# Altium schematic sheet Controller.SchDoc
size A2
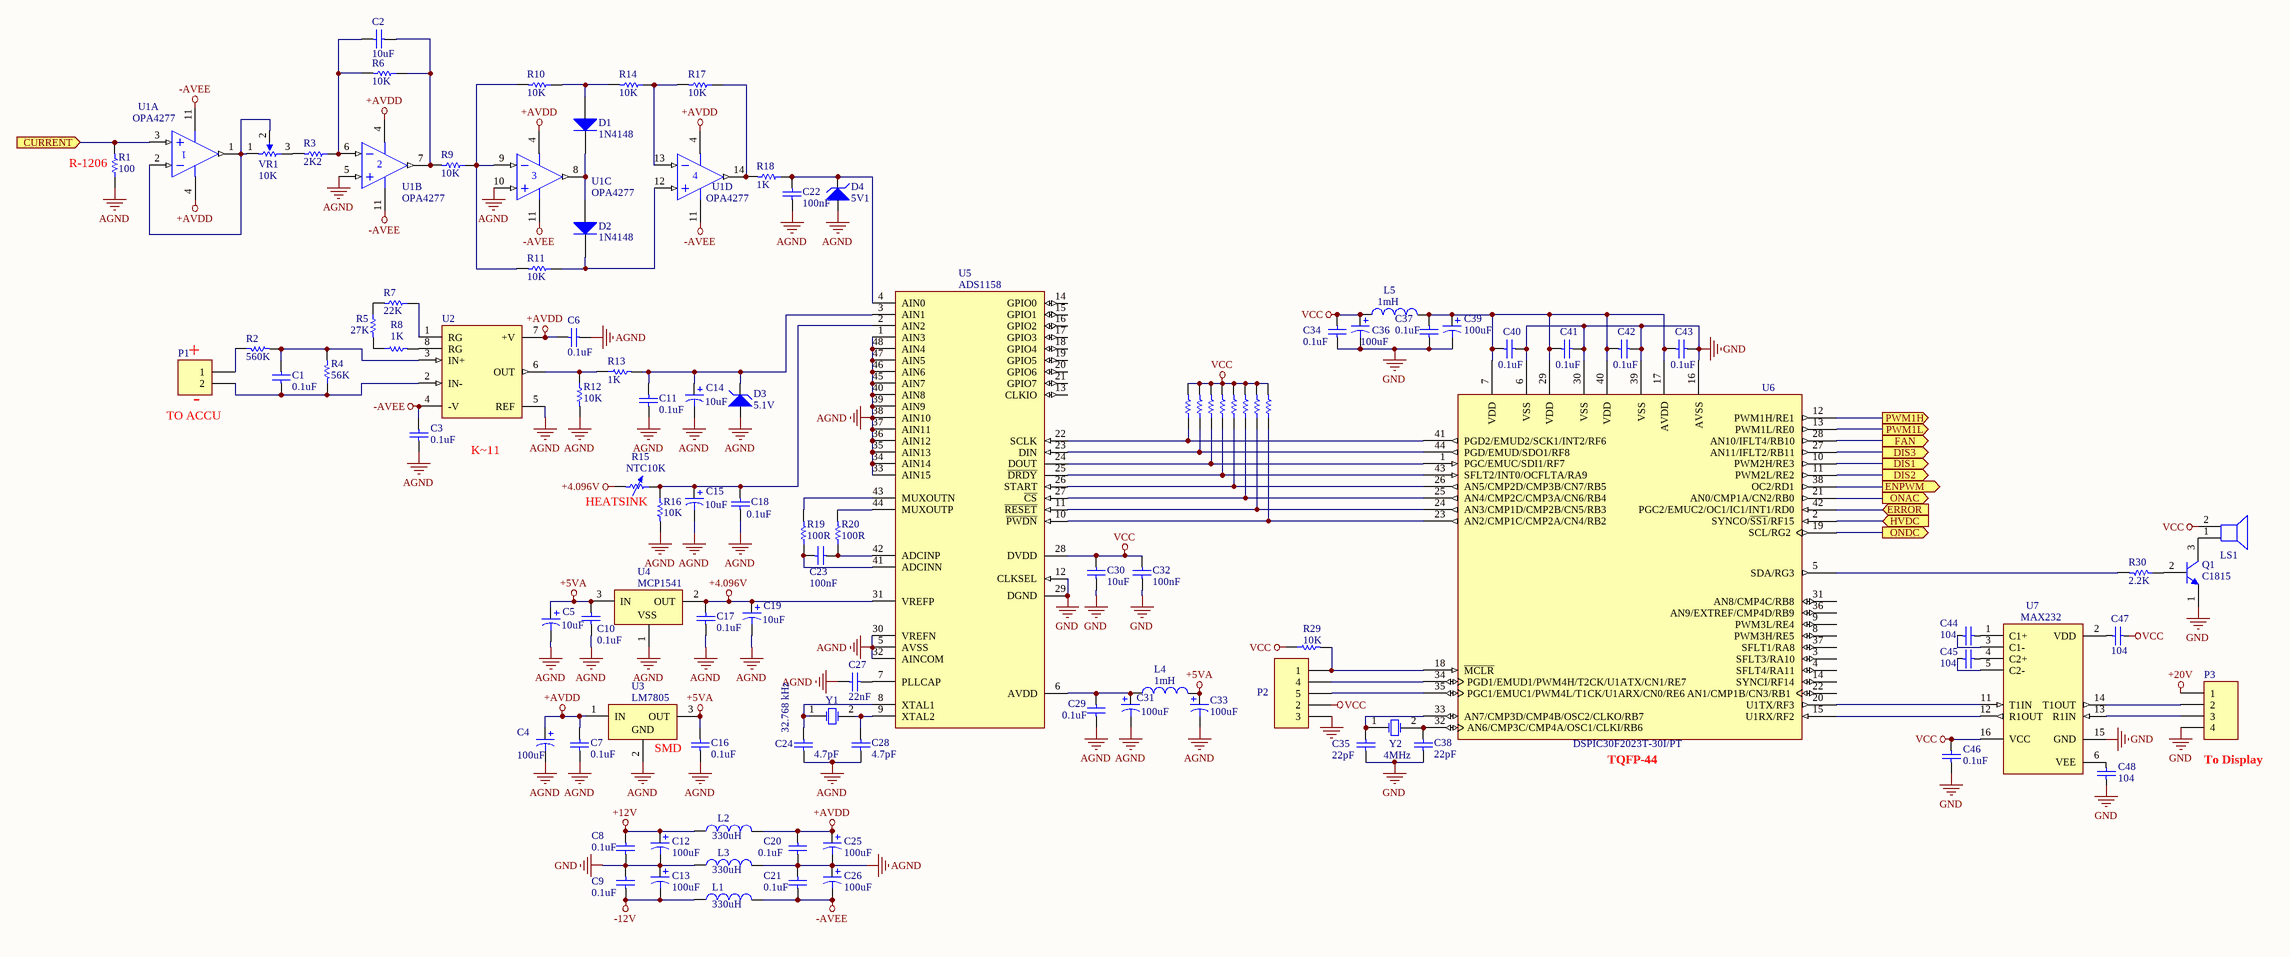
[diagram p0: Controller.SchDoc]

## Parts
C1  0.1uF  [C0805]
C2  10uF  [C0805]
C3  0.1uF  [C0805]
C4  100uF  [C107-SMD]
C5  10uF  [C106-SMD]
C6  0.1uF  [C0805]
C7  0.1uF  [C0805]
C8  0.1uF  [C0805]
C9  0.1uF  [C0805]
C10  0.1uF  [C0805]
C11  0.1uF  [C0805]
C12  100uF  [C107-SMD]
C13  100uF  [C107-SMD]
C14  10uF  [C106-SMD]
C15  10uF  [C106-SMD]
C16  0.1uF  [C0805]
C17  0.1uF  [C0805]
C18  0.1uF  [C0805]
C19  10uF  [C106-SMD]
C20  0.1uF  [C0805]
C21  0.1uF  [C0805]
C22  100nF  [C0805]
C23  100nF  [C0805]
C24  4.7pF  [C0805]
C25  100uF  [C107-SMD]
C26  100uF  [C107-SMD]
C27  22nF  [C0805]
C28  4.7pF  [C0805]
C29  0.1uF  [C0805]
C30  10uF  [C0805]
C31  100uF  [C107-SMD]
C32  100nF  [C0805]
C33  100uF  [C107-SMD]
C34  0.1uF  [C0805]
C35  22pF  [C0805]
C36  100uF  [C107-SMD]
C37  0.1uF  [C0805]
C38  22pF  [C0805]
C39  100uF  [C107-SMD]
C40  0.1uF  [C0805]
C41  0.1uF  [C0805]
C42  0.1uF  [C0805]
C43  0.1uF  [C0805]
C44  104  [C0805]
C45  104  [C0805]
C46  0.1uF  [C0805]
C47  104  [C0805]
C48  104  [C0805]
D1  1N4148  [1N4148-SMD]
D2  1N4148  [1N4148-SMD]
D3  5.1V  [1N4148]
D4  5V1  [1N4148]
L1  330uH  [L-330uH]
L2  330uH  [L-330uH]
L3  330uH  [L-330uH]
L4  1mH  [IND-7447785002]
L5  1mH  [IND-7447785002]
LS1  Speaker  [BEEPER]  (value not drawn)
P1  Header 2  [H2-15A]  (value not drawn)
P2  PROG-KITPIC3  [CON-5B]  (value not drawn)
P3  Header 4  [H4-15A]  (value not drawn)
Q1  C1815  [SOT-23]
R1  100  [R1206]
R2  560K  [R0805]
R3  2K2  [R0805]
R4  56K  [R0805]
R5  27K  [R0805]
R6  10K  [R0805]
R7  22K  [R0805]
R8  1K  [R0805]
R9  10K  [R0805]
R10  10K  [R0805]
R11  10K  [R0805]
R12  10K  [R0805]
R13  1K  [R0805]
R14  10K  [R0805]
R15  NTC10K  [CAP100]
R16  10K  [R0805]
R17  10K  [R0805]
R18  1K  [R0805]
R19  100R  [R0805]
R20  100R  [R0805]
R21  10K  [R0805]  (value not drawn)
R22  10K  [R0805]  (value not drawn)
R23  10K  [R0805]  (value not drawn)
R24  10K  [R0805]  (value not drawn)
R25  10K  [R0805]  (value not drawn)
R26  10K  [R0805]  (value not drawn)
R27  10K  [R0805]  (value not drawn)
R28  10K  [R0805]  (value not drawn)
R29  10K  [R0805]
R30  value 2.2K  [R0805]  (hidden comment: 2K2)
U1  value OPA4277  [SOIC-14]  (hidden comment: OPA4277UA)  (parts A,B,C,D of 4)
U2  INA121  [182H_M]  (value not drawn)
U3  LM7805  [78M05-SMD]
U4  MCP1541  [MCP1541]
U5  ADS1158  [ADS1158]
U6  DSPIC30F2023T-30I/PT  [TQFP-PT44_N]
U7  MAX232  [NSO16_M]
VR1  10K  [RPOT-PV36W]
Y1  32.768 kHz  [XTA-32.768K]
Y2  4MHz  [XTA_SMD]

## Ports
CURRENT (in), DIS1 (out), DIS2 (out), DIS3 (out), ENPWM (out), ERROR (in), FAN (out), HVDC (in), ONAC (out), ONDC (out), PWM1H (out), PWM1L (out)

## Nets
+4.096V: C17.1 C19.1 R15.1 U4.2(OUT) U5.31(VREFP)
+5VA: C5.1 C10.1 C16.1 C33.1 L4.1 U3.3(OUT) U4.3(IN)
+12V: C8.1 C12.1 L2.1
+20V: P3.1
+AVDD: C4.1 C6.1 C7.1 C20.1 C25.1 L2.2 U1.4(V+) U2.7(+V) U3.1(IN)
-12V: C9.2 C13.2 L1.1
-AVEE: C3.1 C21.2 C26.2 L1.2 U1.11(V-) U2.4(-V)
AGND: C3.2 C4.2 C5.2 C6.2 C7.2 C10.2 C11.2 C14.2 C15.2 C16.2 C17.2 C18.2 C19.2 C20.2 C21.1 C22.2 C24.2 C25.2 C26.1 C27.1 C28.2 C29.2 C31.2 C33.2 D3.1(A) D4.1(A) L3.2 R1.1 R12.2 R16.2 U1.5(IN+) U1.10(IN+) U2.5(REF) U3.2(GND) U4.1(VSS) U5.1(AIN3) U5.5(AVSS) U5.30(VREFN) U5.32(AINCOM) U5.33(AIN15) U5.34(AIN14) U5.35(AIN13) U5.36(AIN12) U5.37(AIN11) U5.38(AIN10) U5.39(AIN9) U5.40(AIN8) U5.45(AIN7) U5.46(AIN6) U5.47(AIN5) U5.48(AIN4) Y1.3(AGND)
GND: C8.2 C9.1 C12.2 C13.1 C30.1 C32.2 C34.2 C35.1 C36.2 C37.2 C38.1 C39.2 C40.2 C41.2 C42.2 C43.2 C46.2 C48.1 L3.1 P2.3 P3.4 Q1.1(E) U5.12(CLKSEL) U5.29(DGND) U6.6(VSS) U6.16(AVSS) U6.30(VSS) U6.39(VSS) U7.15(GND)
VCC: C30.2 C32.1 C34.1 C36.1 C46.1 C47.1 L5.1 LS1.2 P2.2 R21.2 R22.2 R23.2 R24.2 R25.2 R26.2 R27.2 R28.2 R29.1 U5.28(DVDD) U7.16(VCC)
CURRENT: R1.2 U1.3(IN+) ; port CURRENT
DIS1: U6.10(PWM2H/RE3) ; port DIS1
DIS2: U6.11(PWM2L/RE2) ; port DIS2
DIS3: U6.27(AN11/IFLT2/RB11) ; port DIS3
ENPWM: U6.38(OC2/RD1) ; port ENPWM
ERROR: U6.42(PGC2/EMUC2/OC1/IC1/INT1/RD0) ; port ERROR
FAN: U6.28(AN10/IFLT4/RB10) ; port FAN
HVDC: U6.2(SYNCO/~{SS1}/RF15) ; port HVDC
ONAC: U6.21(AN0/CMP1A/CN2/RB0) ; port ONAC
ONDC: U6.19(SCL/RG2) ; port ONDC
PWM1H: U6.12(PWM1H/RE1) ; port PWM1H
PWM1L: U6.13(PWM1L/RE0) ; port PWM1L
NetC1_1: C1.1 P1.2 R4.1 U2.2(IN-)
NetC1_2: C1.2 R2.2 R4.2 U2.3(IN+)
NetC2_1: C2.1 R6.1 R9.2 U1.7(OUT)
NetC2_2: C2.2 R3.1 R6.2 U1.6(IN-)
NetC11_1: C11.1 C14.1 D3.2(K) R13.2 U5.3(AIN1)
NetC15_1: C15.1 C18.1 R15.2 R16.1 U5.2(AIN2)
NetC22_1: C22.1 D4.2(K) R18.1 U5.4(AIN0)
NetC23_1: C23.1 R19.1 U5.41(ADCINN)
NetC23_2: C23.2 R20.1 U5.42(ADCINP)
NetC24_1: C24.1 U5.8(XTAL1) Y1.1(OSC1)
NetC27_2: C27.2 U5.7(PLLCAP)
NetC28_1: C28.1 U5.9(XTAL2) Y1.2(OSC2)
NetC29_1: C29.1 C31.1 L4.2 U5.6(AVDD)
NetC35_2: C35.2 U6.33(AN7/CMP3D/CMP4B/OSC2/CLKO/RB7) Y2.1(OSC1)
NetC37_1: C37.1 C39.1 C40.1 C41.1 C42.1 C43.1 L5.2 U6.7(VDD) U6.17(AVDD) U6.29(VDD) U6.40(VDD)
NetC38_2: C38.2 U6.32(AN6/CMP3C/CMP4A/OSC1/CLKI/RB6) Y2.2(OSC2)
NetC44_1: C44.1 U7.1(C1+)
NetC44_2: C44.2 U7.3(C1-)
NetC45_1: C45.1 U7.4(C2+)
NetC45_2: C45.2 U7.5(C2-)
NetC47_2: C47.2 U7.2(VDD)
NetC48_2: C48.2 U7.6(VEE)
NetD1_1: D1.1(A) R10.1 R14.2
NetD1_2: D1.2(K) D2.1(A) U1.8(OUT)
NetD2_2: D2.2(K) R11.1 U1.12(IN+)
NetLS1_1: LS1.1 Q1.3(C)
NetP1_1: P1.1 R2.1
NetP2_1: P2.1 R29.2 U6.18(~{MCLR})
NetP2_4: P2.4 U6.34(PGD1/EMUD1/PWM4H/T2CK/U1ATX/CN1/RE7)
NetP2_5: P2.5 U6.35(PGC1/EMUC1/PWM4L/T1CK/U1ARX/CN0/RE6)
NetP3_2: P3.2 U7.14(T1OUT)
NetP3_3: P3.3 U7.13(R1IN)
NetQ1_2: Q1.2(B) R30.1
NetR3_2: R3.2 VR1.3(TOP)
NetR5_1: R5.1 R7.2
NetR5_2: R5.2 R8.1
NetR7_1: R7.1 U2.1(RG)
NetR8_2: R8.2 U2.8(RG)
NetR9_1: R9.1 R10.2 R11.2 U1.9(IN-)
NetR12_1: R12.1 R13.1 U2.6(OUT)
NetR14_1: R14.1 R17.2 U1.13(IN-)
NetR17_1: R17.1 R18.2 U1.14(OUT)
NetR19_2: R19.2 U5.43(MUXOUTN)
NetR20_2: R20.2 U5.44(MUXOUTP)
NetR21_1: R21.1 U5.22(SCLK) U6.41(PGD2/EMUD2/SCK1/INT2/RF6)
NetR22_1: R22.1 U5.23(DIN) U6.44(PGD/EMUD/SDO1/RF8)
NetR23_1: R23.1 U5.24(DOUT) U6.1(PGC/EMUC/SDI1/RF7)
NetR24_1: R24.1 U5.25(~{DRDY}) U6.43(SFLT2/INT0/OCFLTA/RA9)
NetR25_1: R25.1 U5.26(START) U6.26(AN5/CMP2D/CMP3B/CN7/RB5)
NetR26_1: R26.1 U5.27(~{CS}) U6.25(AN4/CMP2C/CMP3A/CN6/RB4)
NetR27_1: R27.1 U5.11(~{RESET}) U6.24(AN3/CMP1D/CMP2B/CN5/RB3)
NetR28_1: R28.1 U5.10(~{PWDN}) U6.23(AN2/CMP1C/CMP2A/CN4/RB2)
NetR30_2: R30.2 U6.5(SDA/RG3)
NetU1_1: U1.1(OUT) U1.2(IN-) VR1.1(BOT) VR1.2(CW)
NetU6_15: U6.15(U1RX/RF2) U7.12(R1OUT)
NetU6_20: U6.20(U1TX/RF3) U7.11(T1IN)

Not connected (* = marked no-connect by the designer): U5 13(CLKIO) 14(GPIO0) 15(GPIO1) 16(GPIO2) 17(GPIO3) 18(GPIO4) 19(GPIO5) 20(GPIO6) 21(GPIO7); U6 3(SFLT3/RA10) 4(SFLT4/RA11) 8(PWM3H/RE5) 9(PWM3L/RE4) 14(SYNCI/RF14) 22(AN1/CMP1B/CN3/RB1) 31(AN8/CMP4C/RB8) 36(AN9/EXTREF/CMP4D/RB9) 37(SFLT1/RA8); U7 7(T2OUT) 8(R2IN) 9(R2OUT) 10(T2IN)

## Notes on the sheet
- (near R1) R-1206
- (near P1) +
- (near P1) -
- (near P1) TO ACCU
- K~11
- (near R15) HEATSINK
- (near U3) SMD
- (near U6) TQFP-44
- (near P3) To Display

## Library data of the parts
C1 C3 C6-C11 C16-C18 C20 C21 C29 C34 C35 C37 C40-C48 = Cap: Capacitor; Published: 8-Jun-2000; LatestRevisionDate: 17-Jul-2002; LatestRevisionNote: Re-released for DXP Platform.; PackageReference: RAD-0.3; Publisher: Altium Limited
  C1 C3 C6-C11 C16-C18 C20 C21 C29 C34 C37 C40-C43 C46: Value: 0.1uF
  C35: Value: 22pF; NOTE: SMD 0805
  C44 C45 C47 C48: Value: 104
C2 C30 = Cap: CAP CER 10UF 25V X5R 1206; Part Number: GRM31CR61E106KA12L; Manufacturer: Murata Electronics North America; Value: 10uF; Link: http://search.digikey.com/scripts/DkSearch/dksus.dll?Detail&name=490-3373-1-ND
C4 = Cap Pol1: Polarized Capacitor (Radial); Value: 100uF/16V SMD; Published: 8-Jun-2000; LatestRevisionDate: 17-Jul-2002; LatestRevisionNote: Re-released for DXP Platform.; PackageReference: RB7.6-15; Publisher: Altium Limited
C5 C12-C15 C19 C25 C26 C31 C33 C36 C39 = Cap Pol1: Polarized Capacitor (Radial); Published: 8-Jun-2000; LatestRevisionDate: 17-Jul-2002; LatestRevisionNote: Re-released for DXP Platform.; PackageReference: RB7.6-15; Publisher: Altium Limited
  C5 C14 C15 C19: Value: 10uF
  C12 C13 C25 C26 C31 C33 C36 C39: Value: 100uF
C22 C23 C32 = Cap: CAP CER .1UF 16V 10% X7R 0603; Part Number: GRM188R71C104KA01D; Manufacturer: Murata Electronics North America; Value: 100nF; Link: http://search.digikey.com/scripts/DkSearch/dksus.dll?Detail&name=490-1532-1-ND
C24 C28 = Cap: CAP CER 4.7PF 25V C0G 0201; Part Number: GRM0335C1E4R7CD01D; Manufacturer: Murata Electronics North America; Value: 4.7pF; Link: http://search.digikey.com/scripts/DkSearch/dksus.dll?Detail&name=490-3131-1-ND
C27 = Cap: CAP CER 22000PF 16V 10% X7R 0603; Part Number: GRM188R71C223KA01D; Manufacturer: Murata Electronics North America; Value: 22nF; Link: http://search.digikey.com/scripts/DkSearch/dksus.dll?Detail&name=490-1527-1-ND
C38 = Cap: Capacitor; NOTE: SMD0805; Published: 8-Jun-2000; LatestRevisionDate: 17-Jul-2002; LatestRevisionNote: Re-released for DXP Platform.; PackageReference: RAD-0.3; Publisher: Altium Limited; Value: 22pF
D1 D2 = Diode 1N4148: DIODE SWITCH 100V 400MW SOD123; Manufacturer: Diodes Inc; Part Number: 1N4148W-7-F; Value: 1N4148; Link: http://search.digikey.com/scripts/DkSearch/dksus.dll?Detail&name=1N4148W-FDICT-ND
D3 = D Zener: Zener Diode; Value: ZENNER 5.1V; Published: 8-Jun-2000; LatestRevisionDate: 17-Jul-2002; LatestRevisionNote: Re-released for DXP Platform.; PackageReference: DIODE-0.7; Publisher: Altium Limited
D4 = D Zener: Zener Diode; Published: 8-Jun-2000; LatestRevisionDate: 17-Jul-2002; LatestRevisionNote: Re-released for DXP Platform.; PackageReference: DIODE-0.7; Publisher: Altium Limited; Value: 5V1
L1-L5 = Inductor: Code_IEC: 1005; Published: 8-Jun-2000; LatestRevisionDate: 17-Jul-2002; LatestRevisionNote: Re-released for DXP Platform.; PackageReference: 0402-A; Publisher: Altium Limited; Code_JEITA: 0402
  L1-L3: Value: 330uH
  L4 L5: Value: 1mH
LS1 = Speaker: Loudspeaker; Value: Beeper; Published: 24-Mar-1999; LatestRevisionDate: 17-Jul-2002; LatestRevisionNote: Re-released for DXP Platform.; PackageReference: PIN2; Publisher: Altium Limited
P1 = Header 2: Header, 2-Pin; LatestRevisionDate: 17-Jul-2002; LatestRevisionNote: Re-released for DXP Platform.; Publisher: Altium Limited; Value: Header 2
P2 = Header 5: Header, 5-Pin; LatestRevisionDate: 17-Jul-2002; LatestRevisionNote: Re-released for DXP Platform.; Publisher: Altium Limited; Value: PROG-KITPIC3
P3 = Header 4: Header, 4-Pin; LatestRevisionDate: 17-Jul-2002; LatestRevisionNote: Re-released for DXP Platform.; Publisher: Altium Limited; Value: Header 4
Q1 = NPN: NPN Bipolar Transistor; Published: 8-Jun-2000; LatestRevisionDate: 17-Jul-2002; LatestRevisionNote: Re-released for DXP Platform.; PackageReference: TO-226; Publisher: Altium Limited; Code_JEDEC: TO-226-AA; Value: C1815
R1 R3 R6 R9-R11 R14 R17 R18 R29 = Res1: RES 10K OHM 1/8W .1% 0805 SMD; Part Number: ERA-6AEB103V; Manufacturer: Panasonic - ECG; Link: http://search.digikey.com/scripts/DkSearch/dksus.dll?Detail&name=P10KDACT-ND
  R1: Value: 100
  R3: Value: 2K2
  R6 R9-R11 R14 R17 R29: Value: 10K
  R18: Value: 1K
R2 R4 R5 R7 R8 R12 R13 R16 R30 = Res1: Resistor; Published: 8-Jun-2000; LatestRevisionDate: 17-Jul-2002; LatestRevisionNote: Re-released for DXP Platform.; PackageReference: AXIAL-0.3; Publisher: Altium Limited
  R2: Value: 560K; NOTE: SMD 1206
  R4: Value: 56K; NOTE: SMD 1206
  R5: Value: 27K
  R7: Value: 22K
  R8 R13: Value: 1K
  R12 R16: Value: 10K
R15 = Res Adj1: Variable Resistor; Set Position: 0.5; Published: 8-Jun-2000; LatestRevisionDate: 17-Jul-2002; LatestRevisionNote: Re-released for DXP Platform.; PackageReference: AXIAL-0.7; Publisher: Altium Limited; Value: NTC10K
R19 R20 = Res1: RES 100 OHM 1/10W .1% 0603 SMD; Part Number: ERA-3AEB101V; Manufacturer: Panasonic - ECG; Value: 100R; Link: http://search.digikey.com/scripts/DkSearch/dksus.dll?Detail&name=P100DBCT-ND
R21-R28 = Res1: RES 10.0K OHM 1/10W 1% 0603 SMD; Part Number: ERJ-3EKF1002V; Manufacturer: Panasonic - ECG; Value: 10K; Link: http://search.digikey.com/scripts/DkSearch/dksus.dll?Detail&name=P10.0KHCT-ND
U1 = TL084ACN: IC OPAMP GP 1MHZ QUAD 14SOIC; Manufacturer: Texas Instruments; Link: http://search.digikey.com/scripts/DkSearch/dksus.dll?vendor=0&keywords=OPA4277&stock=1; Part Number: OPA4277UA
U2 = INA121UA: FET-Input, Low Power Instrumentation Amplifier; Published: 17-Jul-2002; LatestRevisionDate: 13-Apr-2006; LatestRevisionNote: IPC-7351 Footprint Added.; DatasheetVersion: May-1998; PackageReference: 182H; Publisher: Altium Limited; PackageDescription: 8-Pin Small Outline Integrated Circuit 1.27 mm Pitch; Code_JEDEC: MS-012-AA; Code_IPC: SOIC127P600-8; ComponentLink1Description: Manufacturer Link; ComponentLink1URL: http://www.ti.com/; ComponentLink2Description: Datasheet; ComponentLink2URL: http://www-s.ti.com/sc/ds/INA121.pdf; Value: INA121UA
U3 = MC7805CT: 3-Terminal Positive Fixed Voltage Regulator; Note: Pin 2 is electrically connected to TAB; Published: 17-Jul-2002; DatasheetVersion: 1988; PackageReference: 221A-04; Publisher: Altium Limited; PackageDescription: TO, Thru-Hole, Vertical, Heatsink Mounted; 3 In-Line Leads; Pitch 2.54 mm; Code_JEDEC: TO-262-AA; ComponentLink1Description: Manufacturer Link; ComponentLink1URL: http://www.onsemi.com/site/products/taxonomy/0,4438,503,00.html; ComponentLink2Description: Datasheet; ComponentLink2URL: http://www.onsemi.com/pub/Collateral/MC7800-D.PDF; value: LM7805
U4 = MCP1541-I/TO: 4.096V Voltage Reference, 3-Pin TO-92, Industrial Temperature; Published: 29-Jan-2009; DatasheetVersion: revB, Feb-2005; PackageVersion: revAW, Oct-2008; PackageReference: TO-92-TO3; Publisher: Altium Limited; PackageDescription: 3-Lead Plastic Transistor Outline (TO) [TO-92]; ComponentLink1Description: Manufacturer Link; ComponentLink1URL: http://www.microchip.com; ComponentLink2Description: Datasheet; ComponentLink2URL: http://ww1.microchip.com/downloads/en/DeviceDoc/21653b.pdf; ComponentLink3Description: Packaging Specification; ComponentLink3URL: http://ww1.microchip.com/downloads/en/PackagingSpec/00049AW.pdf; Value: MCP1541
U5 = ADS1158: IC ADC 16BIT 16CH DELT-SIG 48QFN; Part Number: ADS1158IRTCT; Manufacturer: Texas Instruments; Link: http://search.digikey.com/scripts/DkSearch/dksus.dll?Detail&name=296-23494-1-ND; Value: ADS1158
U6 = DSPIC30F2023T-30I/PT: High-Performance 16-bit Digital Signal Controller with Switch Mode Power Supply, 12 KB Flash, 512 Byte SRAM, 44-Pin TQFP, Industrial Temperature, Tape and Reel; Published: 29-Jan-2009; DatasheetVersion: revC, Nov-2006; PackageVersion: revAW, Oct-2008; PackageReference: TQFP-PT44; Publisher: Altium Limited; PackageDescription: 44-Lead Plastic Thin Quad Flatpack (PT) - 10x10x1mm Body, 2.00mm [TQFP]; Code_JEDEC: MS-026; ComponentLink1Description: Manufacturer Link; ComponentLink1URL: http://www.microchip.com; ComponentLink2Description: Datasheet; ComponentLink2URL: http://ww1.microchip.com/downloads/en/DeviceDoc/70178C.pdf; ComponentLink3Description: Packaging Specification; ComponentLink3URL: http://ww1.microchip.com/downloads/en/PackagingSpec/00049AW.pdf; Value: DSPIC30F2023T-30I/PT
U7 = MAX232ACSE: +5V Powered, Multi-Channel RS-232 Driver/Receiver; Published: 16-Jan-2001; LatestRevisionDate: 13-Apr-2006; LatestRevisionNote: IPC-7351 Footprint Added.; PackageReference: NSO16; Publisher: Altium Limited; PackageDescription: 16-Pin Small Outline Integrated Circuit 1.27 mm Pitch; Code_JEDEC: MS-012-AC; Code_IPC: SOIC127P600-16; ComponentLink1Description: Manufacturer Link; ComponentLink1URL: http://www.maxim-ic.com/; ComponentLink2Description: Datasheet; ComponentLink2URL: http://pdfserv.maxim-ic.com/en/ds/MAX220-MAX249.pdf; Value: MAX232
VR1 = RPot1: TRIM POT CERM 200KOHM 25TRN TOP; Part Number: PV36W204C01B00; Manufacturer: Murata Electronics North America; Value: 10K; Link: http://search.digikey.com/scripts/DkSearch/dksus.dll?Detail&name=490-2882-ND
Y1 = XTAL: CRYSTAL 32.768KHZ 12.5PF SMD; Part Number: ABS10-32.768KHZ-1-T; Manufacturer: Abracon Corporation; Value: 32.768 kHz; Link: http://search.digikey.com/scripts/DkSearch/dksus.dll?Detail&name=535-9806-1-ND
Y2 = XTAL: Crystal Oscillator; Published: 8-Jun-2000; LatestRevisionDate: 17-Jul-2002; LatestRevisionNote: Re-released for DXP Platform.; PackageReference: R38; Publisher: Altium Limited; Value: 4MHz